# Altium schematic sheet Группа 4.SchDoc
size 420 x 297 mm
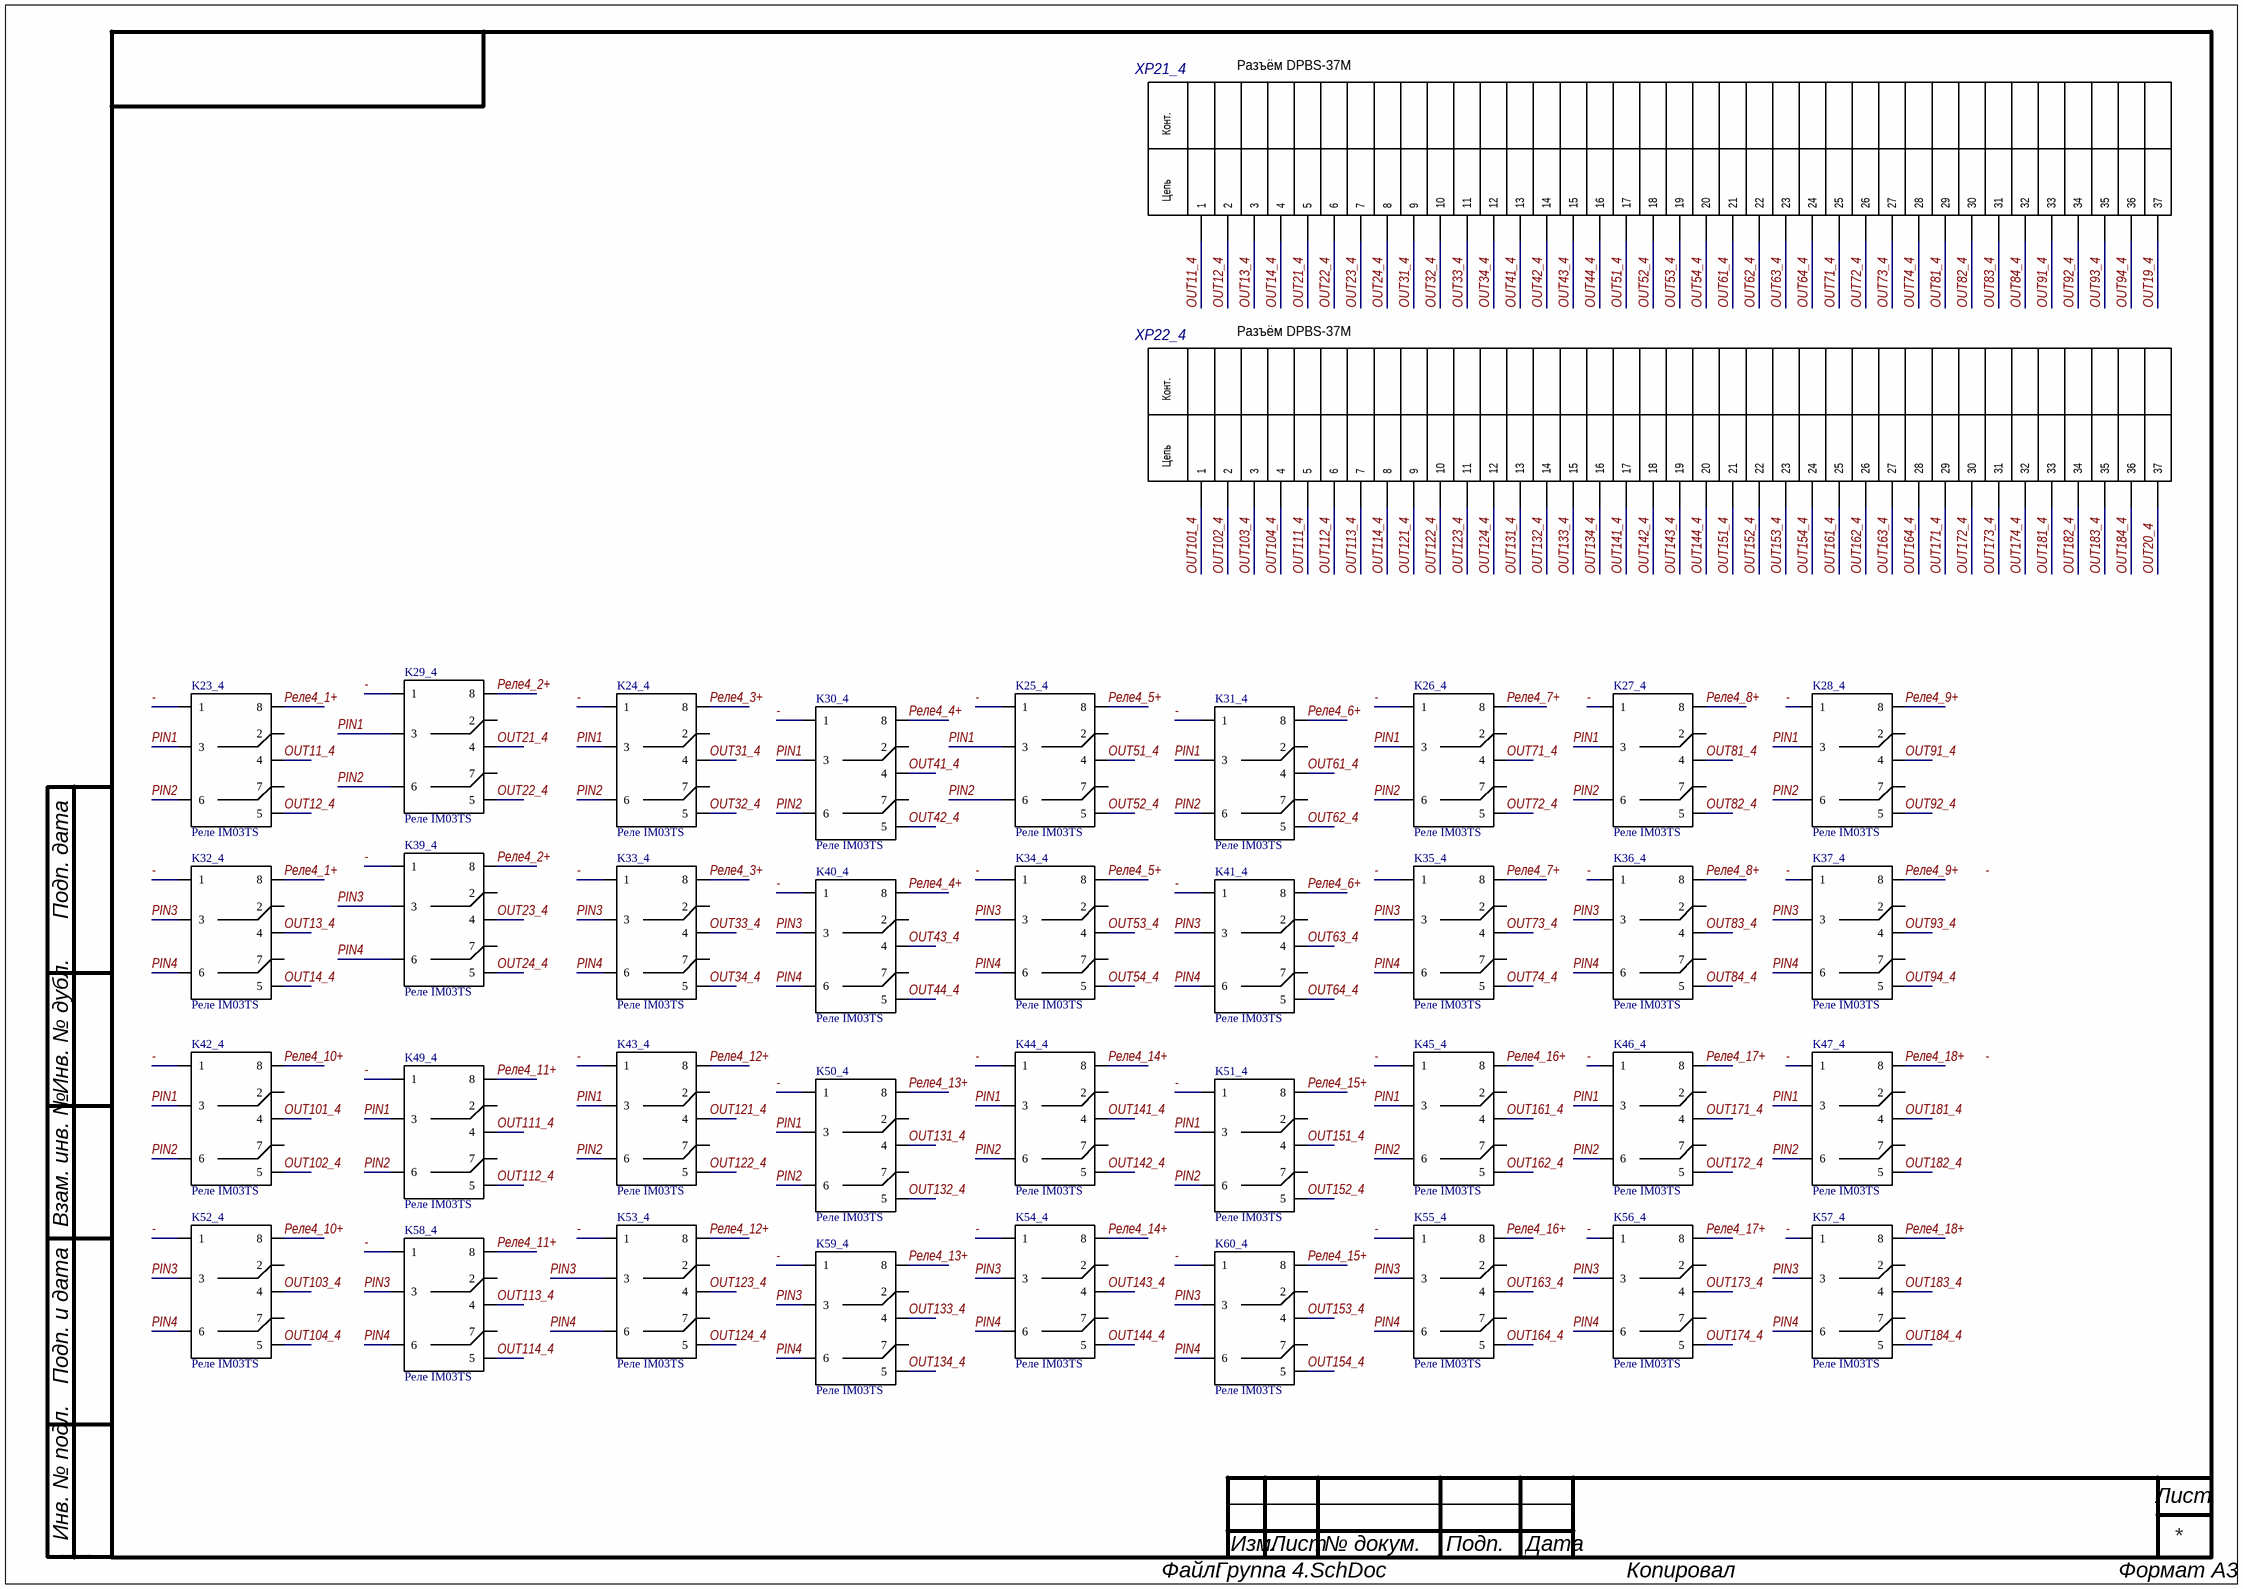
[diagram p0: Группа 4.SchDoc]

## Parts
K23_4  Реле IM03TS  [IM03TS]
K24_4  Реле IM03TS  [IM03TS]
K25_4  Реле IM03TS  [IM03TS]
K26_4  Реле IM03TS  [IM03TS]
K27_4  Реле IM03TS  [IM03TS]
K28_4  Реле IM03TS  [IM03TS]
K29_4  Реле IM03TS  [IM03TS]
K30_4  Реле IM03TS  [IM03TS]
K31_4  Реле IM03TS  [IM03TS]
K32_4  Реле IM03TS  [IM03TS]
K33_4  Реле IM03TS  [IM03TS]
K34_4  Реле IM03TS  [IM03TS]
K35_4  Реле IM03TS  [IM03TS]
K36_4  Реле IM03TS  [IM03TS]
K37_4  Реле IM03TS  [IM03TS]
K39_4  Реле IM03TS  [IM03TS]
K40_4  Реле IM03TS  [IM03TS]
K41_4  Реле IM03TS  [IM03TS]
K42_4  Реле IM03TS  [IM03TS]
K43_4  Реле IM03TS  [IM03TS]
K44_4  Реле IM03TS  [IM03TS]
K45_4  Реле IM03TS  [IM03TS]
K46_4  Реле IM03TS  [IM03TS]
K47_4  Реле IM03TS  [IM03TS]
K49_4  Реле IM03TS  [IM03TS]
K50_4  Реле IM03TS  [IM03TS]
K51_4  Реле IM03TS  [IM03TS]
K52_4  Реле IM03TS  [IM03TS]
K53_4  Реле IM03TS  [IM03TS]
K54_4  Реле IM03TS  [IM03TS]
K55_4  Реле IM03TS  [IM03TS]
K56_4  Реле IM03TS  [IM03TS]
K57_4  Реле IM03TS  [IM03TS]
K58_4  Реле IM03TS  [IM03TS]
K59_4  Реле IM03TS  [IM03TS]
K60_4  Реле IM03TS  [IM03TS]
XP21_4  Разъём DPBS-37M  [DPBS-37M]
XP22_4  Разъём DPBS-37M  [DPBS-37M]

## Nets
-: K23_4.1 K24_4.1 K25_4.1 K26_4.1 K27_4.1 K28_4.1 K29_4.1 K30_4.1 K31_4.1 K32_4.1 K33_4.1 K34_4.1 K35_4.1 K36_4.1 K37_4.1 K39_4.1 K40_4.1 K41_4.1 K42_4.1 K43_4.1 K44_4.1 K45_4.1 K46_4.1 K47_4.1 K49_4.1 K50_4.1 K51_4.1 K52_4.1 K53_4.1 K54_4.1 K55_4.1 K56_4.1 K57_4.1 K58_4.1 K59_4.1 K60_4.1
OUT11_4: K23_4.4 XP21_4.1
OUT12_4: K23_4.5 XP21_4.2
OUT13_4: K32_4.4 XP21_4.3
OUT14_4: K32_4.5 XP21_4.4
OUT19_4: XP21_4.37
OUT20_4: XP22_4.37
OUT21_4: K29_4.4 XP21_4.5
OUT22_4: K29_4.5 XP21_4.6
OUT23_4: K39_4.4 XP21_4.7
OUT24_4: K39_4.5 XP21_4.8
OUT31_4: K24_4.4 XP21_4.9
OUT32_4: K24_4.5 XP21_4.10
OUT33_4: K33_4.4 XP21_4.11
OUT34_4: K33_4.5 XP21_4.12
OUT41_4: K30_4.4 XP21_4.13
OUT42_4: K30_4.5 XP21_4.14
OUT43_4: K40_4.4 XP21_4.15
OUT44_4: K40_4.5 XP21_4.16
OUT51_4: K25_4.4 XP21_4.17
OUT52_4: K25_4.5 XP21_4.18
OUT53_4: K34_4.4 XP21_4.19
OUT54_4: K34_4.5 XP21_4.20
OUT61_4: K31_4.4 XP21_4.21
OUT62_4: K31_4.5 XP21_4.22
OUT63_4: K41_4.4 XP21_4.23
OUT64_4: K41_4.5 XP21_4.24
OUT71_4: K26_4.4 XP21_4.25
OUT72_4: K26_4.5 XP21_4.26
OUT73_4: K35_4.4 XP21_4.27
OUT74_4: K35_4.5 XP21_4.28
OUT81_4: K27_4.4 XP21_4.29
OUT82_4: K27_4.5 XP21_4.30
OUT83_4: K36_4.4 XP21_4.31
OUT84_4: K36_4.5 XP21_4.32
OUT91_4: K28_4.4 XP21_4.33
OUT92_4: K28_4.5 XP21_4.34
OUT93_4: K37_4.4 XP21_4.35
OUT94_4: K37_4.5 XP21_4.36
OUT101_4: K42_4.4 XP22_4.1
OUT102_4: K42_4.5 XP22_4.2
OUT103_4: K52_4.4 XP22_4.3
OUT104_4: K52_4.5 XP22_4.4
OUT111_4: K49_4.4 XP22_4.5
OUT112_4: K49_4.5 XP22_4.6
OUT113_4: K58_4.4 XP22_4.7
OUT114_4: K58_4.5 XP22_4.8
OUT121_4: K43_4.4 XP22_4.9
OUT122_4: K43_4.5 XP22_4.10
OUT123_4: K53_4.4 XP22_4.11
OUT124_4: K53_4.5 XP22_4.12
OUT131_4: K50_4.4 XP22_4.13
OUT132_4: K50_4.5 XP22_4.14
OUT133_4: K59_4.4 XP22_4.15
OUT134_4: K59_4.5 XP22_4.16
OUT141_4: K44_4.4 XP22_4.17
OUT142_4: K44_4.5 XP22_4.18
OUT143_4: K54_4.4 XP22_4.19
OUT144_4: K54_4.5 XP22_4.20
OUT151_4: K51_4.4 XP22_4.21
OUT152_4: K51_4.5 XP22_4.22
OUT153_4: K60_4.4 XP22_4.23
OUT154_4: K60_4.5 XP22_4.24
OUT161_4: K45_4.4 XP22_4.25
OUT162_4: K45_4.5 XP22_4.26
OUT163_4: K55_4.4 XP22_4.27
OUT164_4: K55_4.5 XP22_4.28
OUT171_4: K46_4.4 XP22_4.29
OUT172_4: K46_4.5 XP22_4.30
OUT173_4: K56_4.4 XP22_4.31
OUT174_4: K56_4.5 XP22_4.32
OUT181_4: K47_4.4 XP22_4.33
OUT182_4: K47_4.5 XP22_4.34
OUT183_4: K57_4.4 XP22_4.35
OUT184_4: K57_4.5 XP22_4.36
PIN1: K23_4.3 K24_4.3 K25_4.3 K26_4.3 K27_4.3 K28_4.3 K29_4.3 K30_4.3 K31_4.3 K42_4.3 K43_4.3 K44_4.3 K45_4.3 K46_4.3 K47_4.3 K49_4.3 K50_4.3 K51_4.3
PIN2: K23_4.6 K24_4.6 K25_4.6 K26_4.6 K27_4.6 K28_4.6 K29_4.6 K30_4.6 K31_4.6 K42_4.6 K43_4.6 K44_4.6 K45_4.6 K46_4.6 K47_4.6 K49_4.6 K50_4.6 K51_4.6
PIN3: K32_4.3 K33_4.3 K34_4.3 K35_4.3 K36_4.3 K37_4.3 K39_4.3 K40_4.3 K41_4.3 K52_4.3 K53_4.3 K54_4.3 K55_4.3 K56_4.3 K57_4.3 K58_4.3 K59_4.3 K60_4.3
PIN4: K32_4.6 K33_4.6 K34_4.6 K35_4.6 K36_4.6 K37_4.6 K39_4.6 K40_4.6 K41_4.6 K52_4.6 K53_4.6 K54_4.6 K55_4.6 K56_4.6 K57_4.6 K58_4.6 K59_4.6 K60_4.6
Реле4_1+: K23_4.8 K32_4.8
Реле4_2+: K29_4.8 K39_4.8
Реле4_3+: K24_4.8 K33_4.8
Реле4_4+: K30_4.8 K40_4.8
Реле4_5+: K25_4.8 K34_4.8
Реле4_6+: K31_4.8 K41_4.8
Реле4_7+: K26_4.8 K35_4.8
Реле4_8+: K27_4.8 K36_4.8
Реле4_9+: K28_4.8 K37_4.8
Реле4_10+: K42_4.8 K52_4.8
Реле4_11+: K49_4.8 K58_4.8
Реле4_12+: K43_4.8 K53_4.8
Реле4_13+: K50_4.8 K59_4.8
Реле4_14+: K44_4.8 K54_4.8
Реле4_15+: K51_4.8 K60_4.8
Реле4_16+: K45_4.8 K55_4.8
Реле4_17+: K46_4.8 K56_4.8
Реле4_18+: K47_4.8 K57_4.8

Not connected (* = marked no-connect by the designer): K23_4 2 7; K24_4 2 7; K25_4 2 7; K26_4 2 7; K27_4 2 7; K28_4 2 7; K29_4 2 7; K30_4 2 7; K31_4 2 7; K32_4 2 7; K33_4 2 7; K34_4 2 7; K35_4 2 7; K36_4 2 7; K37_4 2 7; K39_4 2 7; K40_4 2 7; K41_4 2 7; K42_4 2 7; K43_4 2 7; K44_4 2 7; K45_4 2 7; K46_4 2 7; K47_4 2 7; K49_4 2 7; K50_4 2 7; K51_4 2 7; K52_4 2 7; K53_4 2 7; K54_4 2 7; K55_4 2 7; K56_4 2 7; K57_4 2 7; K58_4 2 7; K59_4 2 7; K60_4 2 7

## Notes on the sheet
- Labels drawn without touching a wire or pin: -
- Подп. дата
- Инв. № дубл.
- Взам. инв. №
- Подп. и дата
- Инв. № подл.
- Изм.
- Лист
- № докум.
- Подп.
- Дата
- ALTIUM GOSTBOM2.0 KEV
- Файл:
- Копировал
- Формат А3
- (in symbol DPBS-37M) Конт.; Цепь

## Library data of the parts
K23_4 K24_4 K25_4 K26_4 K27_4 K28_4 K29_4 K30_4 K31_4 K32_4 K33_4 K34_4 K35_4 K36_4 K37_4 K39_4 K40_4 K41_4 K42_4 K43_4 K44_4 K45_4 K46_4 K47_4 K49_4 K50_4 K51_4 K52_4 K53_4 K54_4 K55_4 K56_4 K57_4 K58_4 K59_4 K60_4 = IM03TS: Реле
XP21_4 XP22_4 = DPBS-37M